# Altium schematic sheet Umbilical_eFuse.SchDoc
size 297 x 209 mm; SheetNumber: 8; SheetTotal: 9
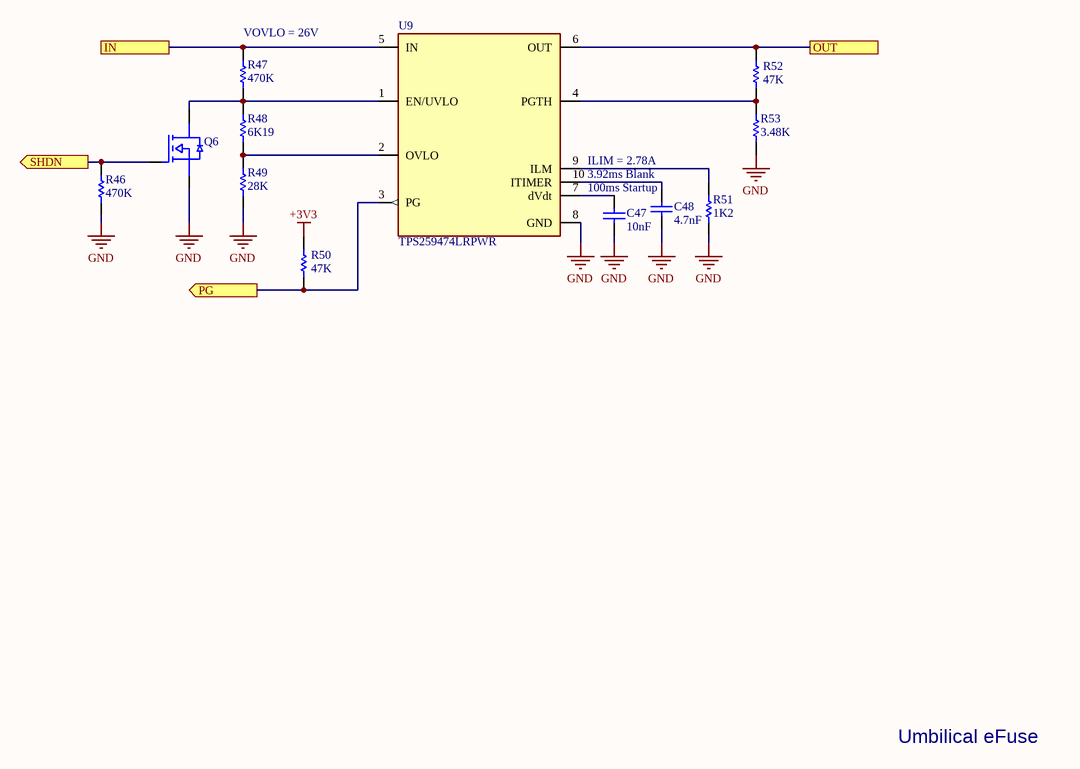
[diagram p0: Umbilical_eFuse.SchDoc]

## Parts
C47  Capacitance: 10nF  [CAPC0603X060]  (hidden comment: CL10B103KB8NNNC)
C48  Capacitance: 4.7nF  [CAPC0603X040]  (hidden comment: C0603C472K4RECAUTO)
Q6  T2N7002AK,LM  [SOT23-3 MOSFET]  (value not drawn)
R46  Resistance: 470K  [RESC0603]  (hidden comment: RMCF0603FT470K)
R47  Resistance: 470K  [RESC0603]  (hidden comment: RMCF0603FT470K)
R48  Resistance: 6K19  [RESC0603]  (hidden comment: RMCF0603FT6K19)
R49  Resistance: 28K  [RESC0603]  (hidden comment: RMCF0603FT28K0)
R50  Resistance: 47K  [RESC0603]  (hidden comment: RMCF0603FT47K0)
R51  Resistance: 1K2  [RESC0603]  (hidden comment: RMCF0603FT1K2)
R52  Resistance: 47K  [RESC0603]  (hidden comment: RMCF0603FT47K0)
R53  Resistance: 3.48K  [RESC0603]  (hidden comment: RMCF0603FT3K48)
U9  TPS259474LRPWR  [VFQFN-10]

## Ports
IN (see Power_Path[3B], Charger[1B]), OUT (see Power_Path[3B], Battery_eFuse[5B]), PG (out, see Power_Path[3B]), SHDN (out, see Power_Path[3B])

## Nets
+3V3: R50.2
GND: C47.1 C48.1 Q6.S R46.1 R49.1 R51.1 R53.1 U9.8(GND)
IN: R47.2 U9.5(IN) ; port IN
OUT: R52.2 U9.6(OUT) ; port OUT
PG: R50.1 U9.3(PG) ; port PG
SHDN: Q6.G R46.2 ; port SHDN
NetC47_2: C47.2 U9.7(dVdt)
NetC48_2: C48.2 U9.10(ITIMER)
NetQ6_D: Q6.D R47.1 R48.2 U9.1(EN/UVLO)
NetR48_1: R48.1 R49.2 U9.2(OVLO)
NetR51_2: R51.2 U9.9(ILM)
NetR52_1: R52.1 R53.2 U9.4(PGTH)

## Notes on the sheet
- (near R47) VOVLO = 26V
- ILIM = 2.78A
- 3.92ms Blank
- 100ms Startup
- Umbilical eFuse
- Size:
- Title:
- A4
- Project:
- Rev:
- Date:
- Drawn By:
- Sheet:
- of

## Library data of the parts
C47 = CL10B103KB8NNNC: 10nF ±10% 50V Ceramic Capacitor X7R 0603 (1608 Metric); Part Number: CL10B103KB8NNNC; Distributor Part Number: 1276-1009-1-ND; Tolerance: 10%; Case Code: 0603; Distributor: Digikey; Voltage Rating: 50V
C48 = C0603C472K4RECAUTO: 4.7nF ±10% 16V Ceramic Capacitor X7R 0603 (1608 Metric); Part Number: C0603C472K4RECAUTO; Tolerance: 10%; Distributor Part number: 399-17879-1-ND; Case Code: 0603; Distributor: Digikey; Dielectric: X7R; Voltage Rating: 16V
Q6 = T2N7002AK,LM: N-Channel 60 V 200mA (Ta) 320mW (Ta) Surface Mount SOT-23-3; Drain to Source Voltage: 60V; Rds On (Max) @ Id, Vgs: 3.9ohm; Vgs(th) (Max) @ Id: 2.1V @ 250µA; (Id) @ 25°C: 200mA; Vgs (Max): *; Power Dissipation (Max): 320mW (Ta); Operating Temperature: -55C - 150C; Part Number: T2N7002AK,LM; Distributor Part Number: T2N7002AKLMCT-ND; Distributor: Digikey
R46 R47 = RMCF0603FT470K: 470 kOhms ±1% 0.1W, 1/10W Chip Resistor 0603 (1608 Metric) Automotive AEC-Q200 Thick Film; Part Number: RMCF0603FT470K; Tolerance: 1%; Distributor: Digikey; Distributor Part Number: RMCF0603FT470KCT-ND; Case Code: 0603
R48 = RMCF0603FT6K19: 6.19 kOhms ±1% 0.1W, 1/10W Chip Resistor 0603 (1608 Metric) Automotive AEC-Q200 Thick Film; Part Number: RMCF0603FT6K19; Tolerance: 1%; Distributor: Digikey; Distributor Part Number: RMCF0603FT6K19CT-ND; Case Code: 0603
R49 = RMCF0603FT28K0: 28 kOhms ±1% 0.1W, 1/10W Chip Resistor 0603 (1608 Metric) Automotive AEC-Q200 Thick Film; Part Number: RMCF0603FT28K0; Tolerance: 1%; Distributor: Digikey; Distributor Part Number: RMCF0603FT28K0CT-ND; Case Code: 0603
R50 R52 = RMCF0603FT47K0: 47 kOhms ±1% 0.1W, 1/10W Chip Resistor 0603 (1608 Metric) Automotive AEC-Q200 Thick Film; Part Number: RMCF0603FT47K0; Tolerance: 1%; Distributor Part Number: RMCF0603FT47K0CT-ND; Distributor: Digikey; Case Code: 0603
R51 = RMCF0603FT1K2: 1.2 kOhms ±1% 0.1W, 1/10W Chip Resistor 0603 (1608 Metric) Automotive AEC-Q200 Thick Film; Part Number: RMCF0603FT1K2; Tolerance: 1%; Distributor: Digikey; Distributor Part Number: RMCF0603FT1K20CT-ND; Case Code: 0603
R53 = RMCF0603FT3K48: 3.48 kOhms ±1% 0.1W, 1/10W Chip Resistor 0603 (1608 Metric) Automotive AEC-Q200 Thick Film; Part Number: RMCF0603FT3K48; Tolerance: 1%; Distributor: Digikey; Distributor Part Number: RMCF0603FT3K48CT-ND; Case Code: 0603
U9 = TPS259474LRPWR: eFuse 5.5A, 2.7V~23V, 28mOhm, Reverse Current Blocking with Input Reverse Polarity Protection; Part Number: TPS259474LRPWR; Distributor: Digikey; Distributor Part Number: 296-TPS259474LRPWRCT-ND; Operating Temperature: -40°C ~ 125°C; Output Current: 5.5A; Voltage Input: 2.7V~23V